# EAGLE schematic SmartRock_EC_V3_2_1_AGU (EAGLE 9.5.1)
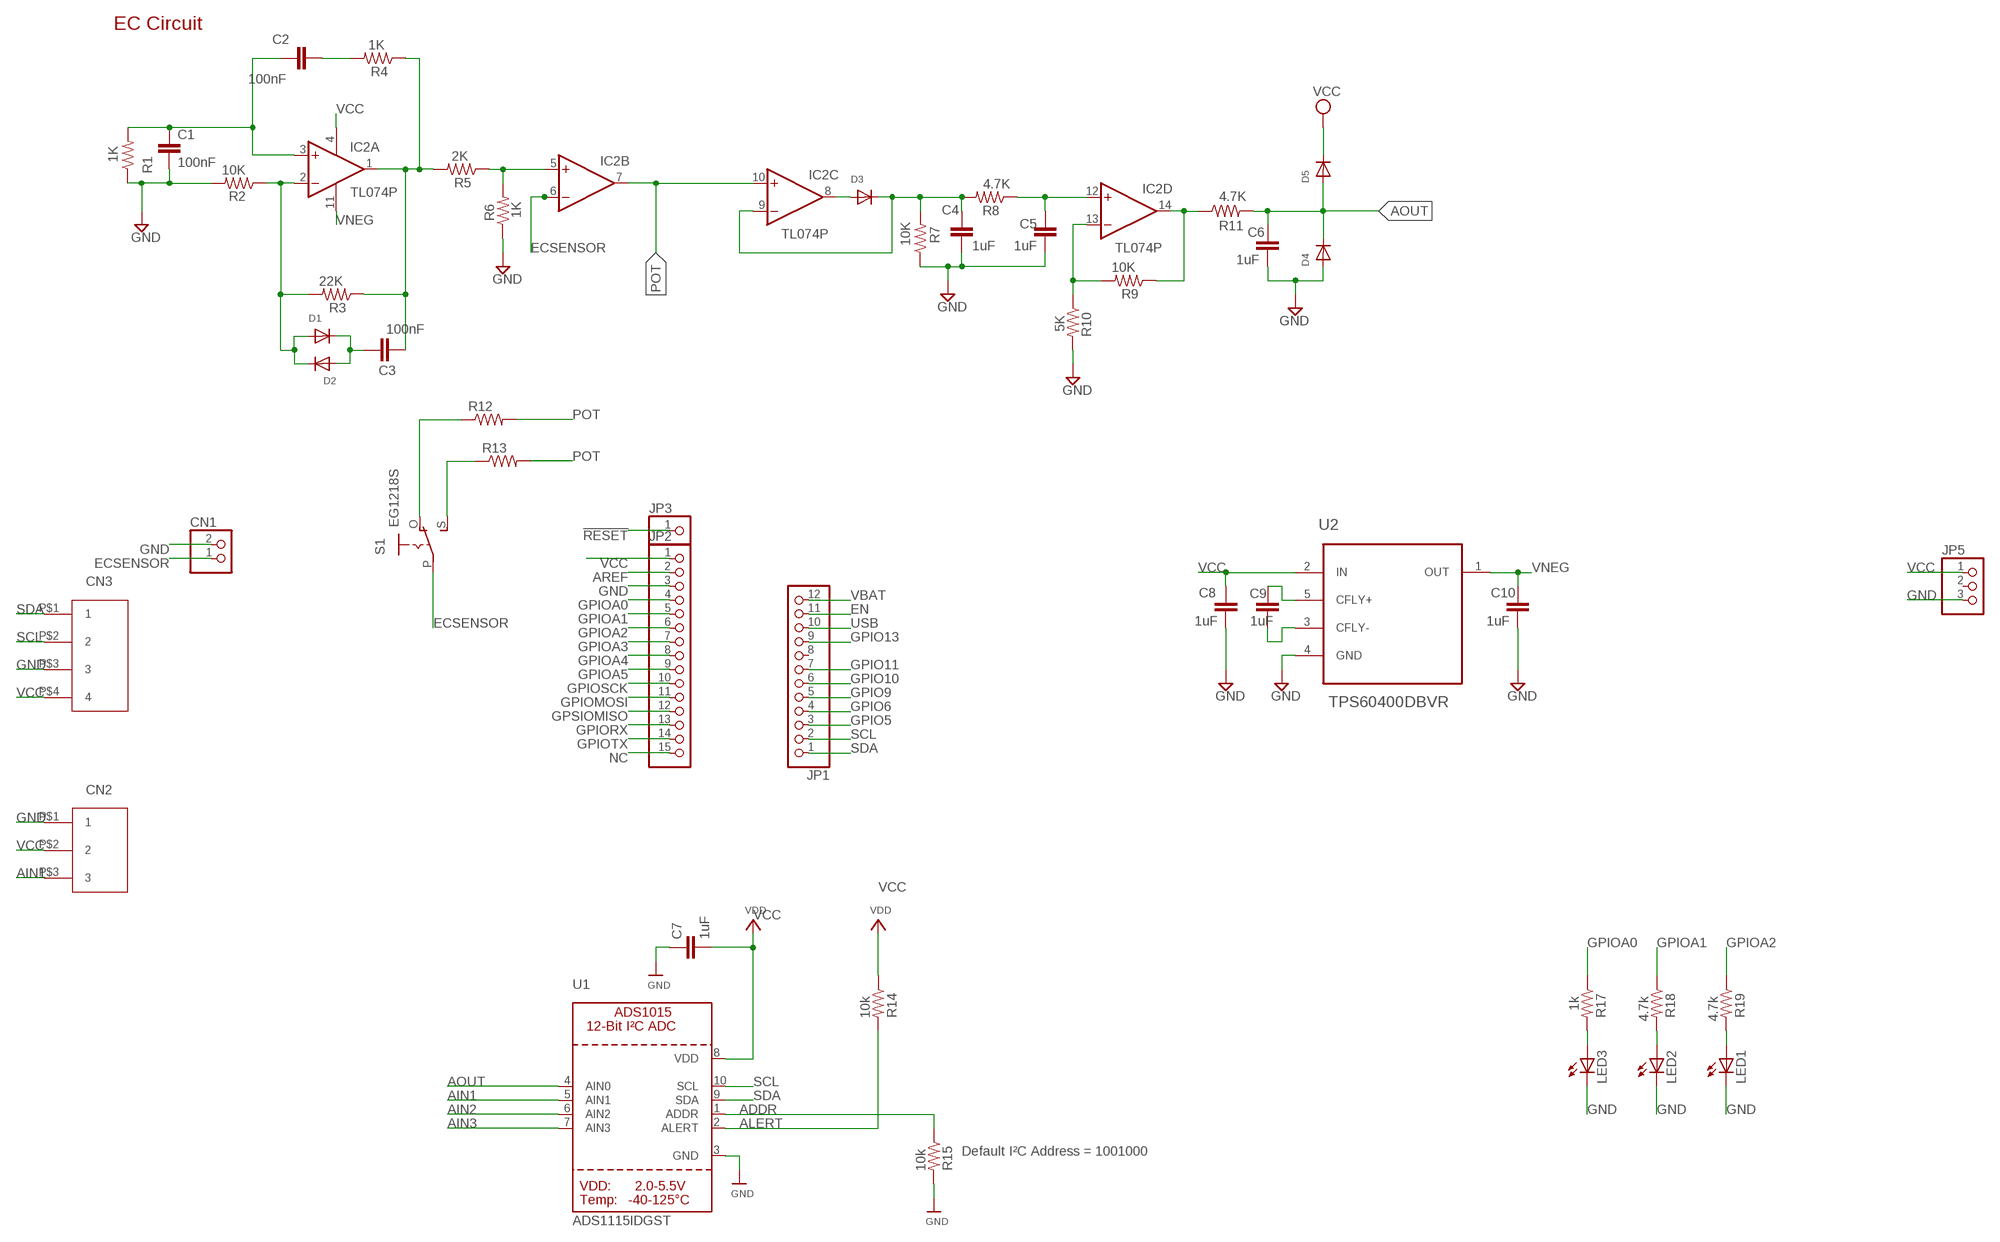
[diagram p0: schematic, sheet 1]

## Parts
C1  100nF  C-EUC1206  [C1206]
C2  100nF  C-EUC1206  [C1206]
C3  100nF  C-EUC1206  [C1206]
C4  1uF  C-EUC1206  [C1206]
C5  1uF  C-EUC1206  [C1206]
C6  1uF  C-EUC1206  [C1206]
C7  1uF  C-EUC1206  [C1206]
C8  1uF  C-EUC1206  [C1206]
C9  1uF  C-EUC1206  [C1206]
C10  1uF  C-EUC1206  [C1206]
CN1  JST_2PIN-THM  [JST-PH-2-THM]
D1  DIODEDO-1N4148  [DO-1N4148]
D2  DIODEDO-1N4148  [DO-1N4148]
D3  DIODEDO-1N4148  [DO-1N4148]
D4  DIODEDO-1N4148  [DO-1N4148]
D5  DIODEDO-1N4148  [DO-1N4148]
IC2  TL074P  [DIL14]
JP1  PINHD-1X12-CB  [1X12-CB]
JP2  PINHD-1X15-CB  [1X15-CB]
JP3  PINHD-1X1CB  [1X01-CLEANBIG]
JP5  PINHD-1X3CB  [1X03-CLEANBIG]
LED1  LEDSMT1206  [1206]
LED2  LEDSMT1206  [1206]
LED3  LEDSMT1206  [1206]
R1  1K  R-US_R1206  [R1206]
R2  10K  R-US_R1206  [R1206]
R3  22K  R-US_R1206  [R1206]
R4  1K  R-US_R1206  [R1206]
R5  2K  R-US_R1206  [R1206]
R6  1K  R-US_R1206  [R1206]
R7  10K  R-US_R1206  [R1206]
R8  4.7K  R-US_R1206  [R1206]
R9  10K  R-US_R1206  [R1206]
R10  5K  R-US_R1206  [R1206]
R11  4.7K  R-US_R1206  [R1206]
R12  R-US_0204/7  [0204/7]
R13  R-US_0204/7  [0204/7]
R14  10k  R-US_R1206  [R1206]
R15  10k  R-US_R1206  [R1206]
R17  1k  R-US_R1206  [R1206]
R18  4.7k  R-US_R1206  [R1206]
R19  4.7k  R-US_R1206  [R1206]
S1  EG1218S  [EG1218]
U1  ADS1115IDGST  ADC_ADS1015  [MSOP10]
U2  TPS60400DBVR  [SOT95P280X145-5N]
U$7  JST_4PIN_2MM  [JST_4PIN_2MM]
U$9  JST_3PIN_2MM  [JST_3PIN_2MM]

## Nets
!RESET: JP3.1
ADDR: R15.1 U1.1(ADDR)
AIN1: U1.5(AIN1) U$9.P$3
AIN2: U1.6(AIN2)
AIN3: U1.7(AIN3)
ALERT: R14.2 U1.2(ALERT)
AOUT: C6.2 D4.C D5.A R11.2 U1.4(AIN0)
AREF: JP2.2
ECSENSOR: CN1.1 IC2.6(B:-IN) S1.P
EN: JP1.11
GND: C1.2 C4.1 C5.1 C6.1 C7.1 C8.1 C10.1 CN1.2 D4.A JP2.3 JP5.3 LED1.C LED2.C LED3.C R1.1 R2.2 R6.1 R7.1 R10.2 R15.2 U1.3(GND) U2.4(GND) U$7.P$3 U$9.P$1
GPIO5: JP1.3
GPIO6: JP1.4
GPIO9: JP1.5
GPIO10: JP1.6
GPIO11: JP1.7
GPIO13: JP1.9
GPIOA0: JP2.4 R17.1
GPIOA1: JP2.5 R18.1
GPIOA2: JP2.6 R19.1
GPIOA3: JP2.7
GPIOA4: JP2.8
GPIOA5: JP2.9
GPIOMOSI: JP2.11
GPIORX: JP2.13
GPIOSCK: JP2.10
GPIOTX: JP2.14
GPSIOMISO: JP2.12
N$1: C1.1 C2.1 IC2.3(A:+IN) R1.2
N$2: C2.2 R4.2
N$3: C3.2 IC2.1(A:OUT) R3.1 R4.1 R5.2
N$4: D1.A D2.C IC2.2(A:-IN) R2.1 R3.2
N$5: IC2.5(B:+IN) R5.1 R6.2
N$7: R13.1 S1.S
N$8: R12.1 S1.O
N$9: C3.1 D1.C D2.A
N$12: C4.2 D3.C IC2.9(C:-IN) R7.2 R8.2
N$13: D3.A IC2.8(C:OUT)
N$15: C5.2 IC2.12(D:+IN) R8.1
N$16: IC2.13(D:-IN) R9.2 R10.1
N$18: IC2.14(D:OUT) R9.1 R11.1
N$20: LED3.A R17.2
N$21: LED2.A R18.2
N$22: LED1.A R19.2
N$27: C9.2 U2.5(CFLY+)
N$28: C9.1 U2.3(CFLY-)
NC: JP2.15
POT: IC2.7(B:OUT) IC2.10(C:+IN) R12.2 R13.2
SCL: JP1.2 U1.10(SCL) U$7.P$2
SDA: JP1.1 U1.9(SDA) U$7.P$1
USB: JP1.10
VBAT: JP1.12
VCC: C7.2 C8.2 D5.C IC2.4(P:V+) JP2.1 JP5.1 R14.1 U1.8(VDD) U2.2(IN) U$7.P$4 U$9.P$2 ; supply symbol labelled VDD
VNEG: C10.2 IC2.11(P:V-) U2.1(OUT)
Unconnected: JP1.8 JP5.2

## Notes on the sheet
- EC Circuit
- CN3
- CN2
- Default I²C Address = 1001000

## Library data of the parts
C1-C10 = rcl:C-EU: CAPACITOR, European symbol; SPICEPREFIX: C
CN1 = adafruit:JST_2PIN: JST 2-Pin Connectors of various flavors SMT-RA (S2B-PH-SM4) 4UConnector #17311 SMT (B2B-PH-SM4) THM-RA (S2B-PH) THM (B2B-PH)
D1-D5 = adafruit:DIODE: Diode SMADIODE - SMA Surface Mount Package 20V 1A Schottky Diode Digikey: 641-1014-6-ND DO-1N4148 - Through Hole Small Current Diode SOD-123 20V 1 A (.5mV Vf) Schottky Diode - Digikey: MBRX120TPMSCT-ND SOD-323 10V 570mA (.38mV Vf, 3ns) Schottky Diode - Digikey: ZLLS410CT-ND SOD-523 30V 30mA Schottky Diode (RB751S-40TE61) - Digikey: RB751S-40TE61CT-ND SOT23-R/W - SOT23 Package (R = Solder Paste/Reflow Ovens, W = Hand-Soldering) BAT54Film 40V 300mA - Digikey: 497-7162-1-ND
IC2 = linear:TL074: OP AMP
JP1 = adafruit:PINHD-1X12: PIN HEADER
JP2 = adafruit:PINHD-1X15: PIN HEADER
JP3 = adafruit:PINHD-1X1: Pin header 1x1 for 0.1" spacing With round pins
JP5 = adafruit:PINHD-1X3: PIN HEADER
LED1-LED3 = adafruit:LED: LED OSRAM: - CHIPLED LG R971, LG N971, LY N971, LG Q971, LY Q971, LO R971, LY R971 LH N974, LH R974 LS Q976, LO Q976, LY Q976 LO Q996 - Hyper CHIPLED LW Q18S LB Q993, LB Q99A, LB R99A - SideLED LS A670, LO A670, LY A670, LG A670, LP A670 LB A673, LV A673, LT A673, LW A673 LH A674 LY A675 LS A676, LA A676, LO A676, LY A676, LW A676 LS A679, LY A679, LG A679 - Hyper Micro SIDELED® LS Y876, LA Y876, LO Y876, LY Y876 LT Y87S - SmartLED LW L88C, LW L88S LB L89C, LB L89S, LG L890 LS L89K, LO L89K, LY L89K LS L896, LA L896, LO L896, LY L896 - TOPLED LS T670, LO T670, LY T670, LG T670, LP T670 LSG T670, LSP T670, LSY T670, LOP T670, LYG T670 LG T671, LOG T671, LSG T671 LB T673, LV T673, LT T673, LW T673 LH T674 LS T676, LA T676, LO T676, LY T676, LB T676, LH T676, LSB T676, LW T676 LB T67C, LV T67C, LT T67C, LS T67K, LO T67K, LY T67K, LW E67C LS E67B, LA E67B, LO E67B, LY E67B, LB E67C, LV E67C, LT E67C LW T67C LS T679, LY T679, LG T679 LS T770, LO T770, LY T770, LG T770, LP T770 LB T773, LV T773, LT T773, LW T773 LH T774 LS E675, LA E675, LY E675, LS T675 LS T776, LA T776, LO T776, LY T776, LB T776 LHGB T686 LT T68C, LB T68C - Hyper Mini TOPLED® LB M676 - Mini TOPLED Santana® LG M470 LS M47K, LO M47K, LY M47K Source: http://www.osram.convergy.de/
R1-R11 R14 R15 R17-R19 = rcl:R-US_: RESISTOR, American symbol; SPICEPREFIX: R
R12 R13 = adafruit:R-US_: RESISTOR, American symbol
S1 = EG1218:EG1218: SLIDING SWITCH 0.1" spacing through hole, vertical SPDT slide switch http://www.ladyada.net/library/pcb/eaglelibrary.html; DESCRIPTION: Slide Switch SPDT Through Hole; DIGI-KEY_PART_NUMBER: EG1218A-ND; MF: E-Switch; MP: EG1218; PACKAGE: None; PURCHASE-URL: https://pricing.snapeda.com/search/part/EG1218/?ref=eda
U1 = microbuilder:ADC_ADS1015: ADS1015 - 12-bit 4-Channel I2C ADC with Internal PGA VDD: 2.0-5.5V Sampling Rate: 3.3ksps Gain Settings: 2/3, 1, 2, 4, 8, 16 I2C Address: ADDR low = 1001000x, ADDR high = 1001001x Internal Comparator The ADS1015 includes an internal comparator that can be set to output a high-level on ALERT when the conversion results exceeeds a pre-defined upper level, and will deassert itself when the level falls below a pre-defined lower threshold level. It can also be set to windowed mode where the ALERT pin will be asserted if the data exceeds the upper threshold or falls below the lower threshold.
U2 = TPS60400DBVR:TPS60400DBVR: Unregulated 60mA charge pump Voltage Inverter; AVAILABILITY: Unavailable; DESCRIPTION: 60mA Charge Pump Voltage Inverter with Variable Switching Frequency 5-SOT-23 -40 to 85; MF: Texas Instruments; MP: TPS60400DBVR; PACKAGE: SOT-23-5 Texas Instruments; PRICE: None
U$7 = JSTconnector:JST_4PIN_2MM
U$9 = JSTconnector:JST_3PIN_2MM

## Net classes
0 default: width 0.305 mm